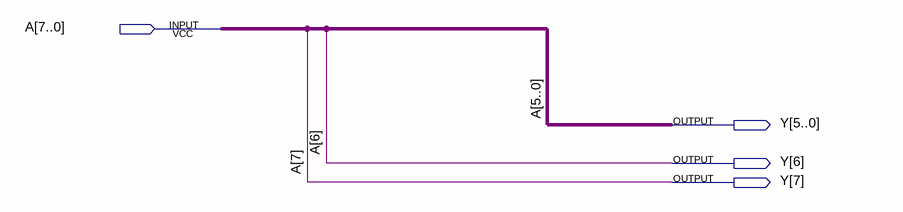
[diagram p0: schematic sheet]
// Quartus schematic Cut7_5.bdf as structural Verilog: 0 symbols, 4 pins
module Cut7_5 (
  input  [7:0] A,
  output [7:0] Y
);


  assign Y = A;
endmodule
